# EAGLE design PM-BAT v1.0-35X22.86 (EAGLE 9.6.2)
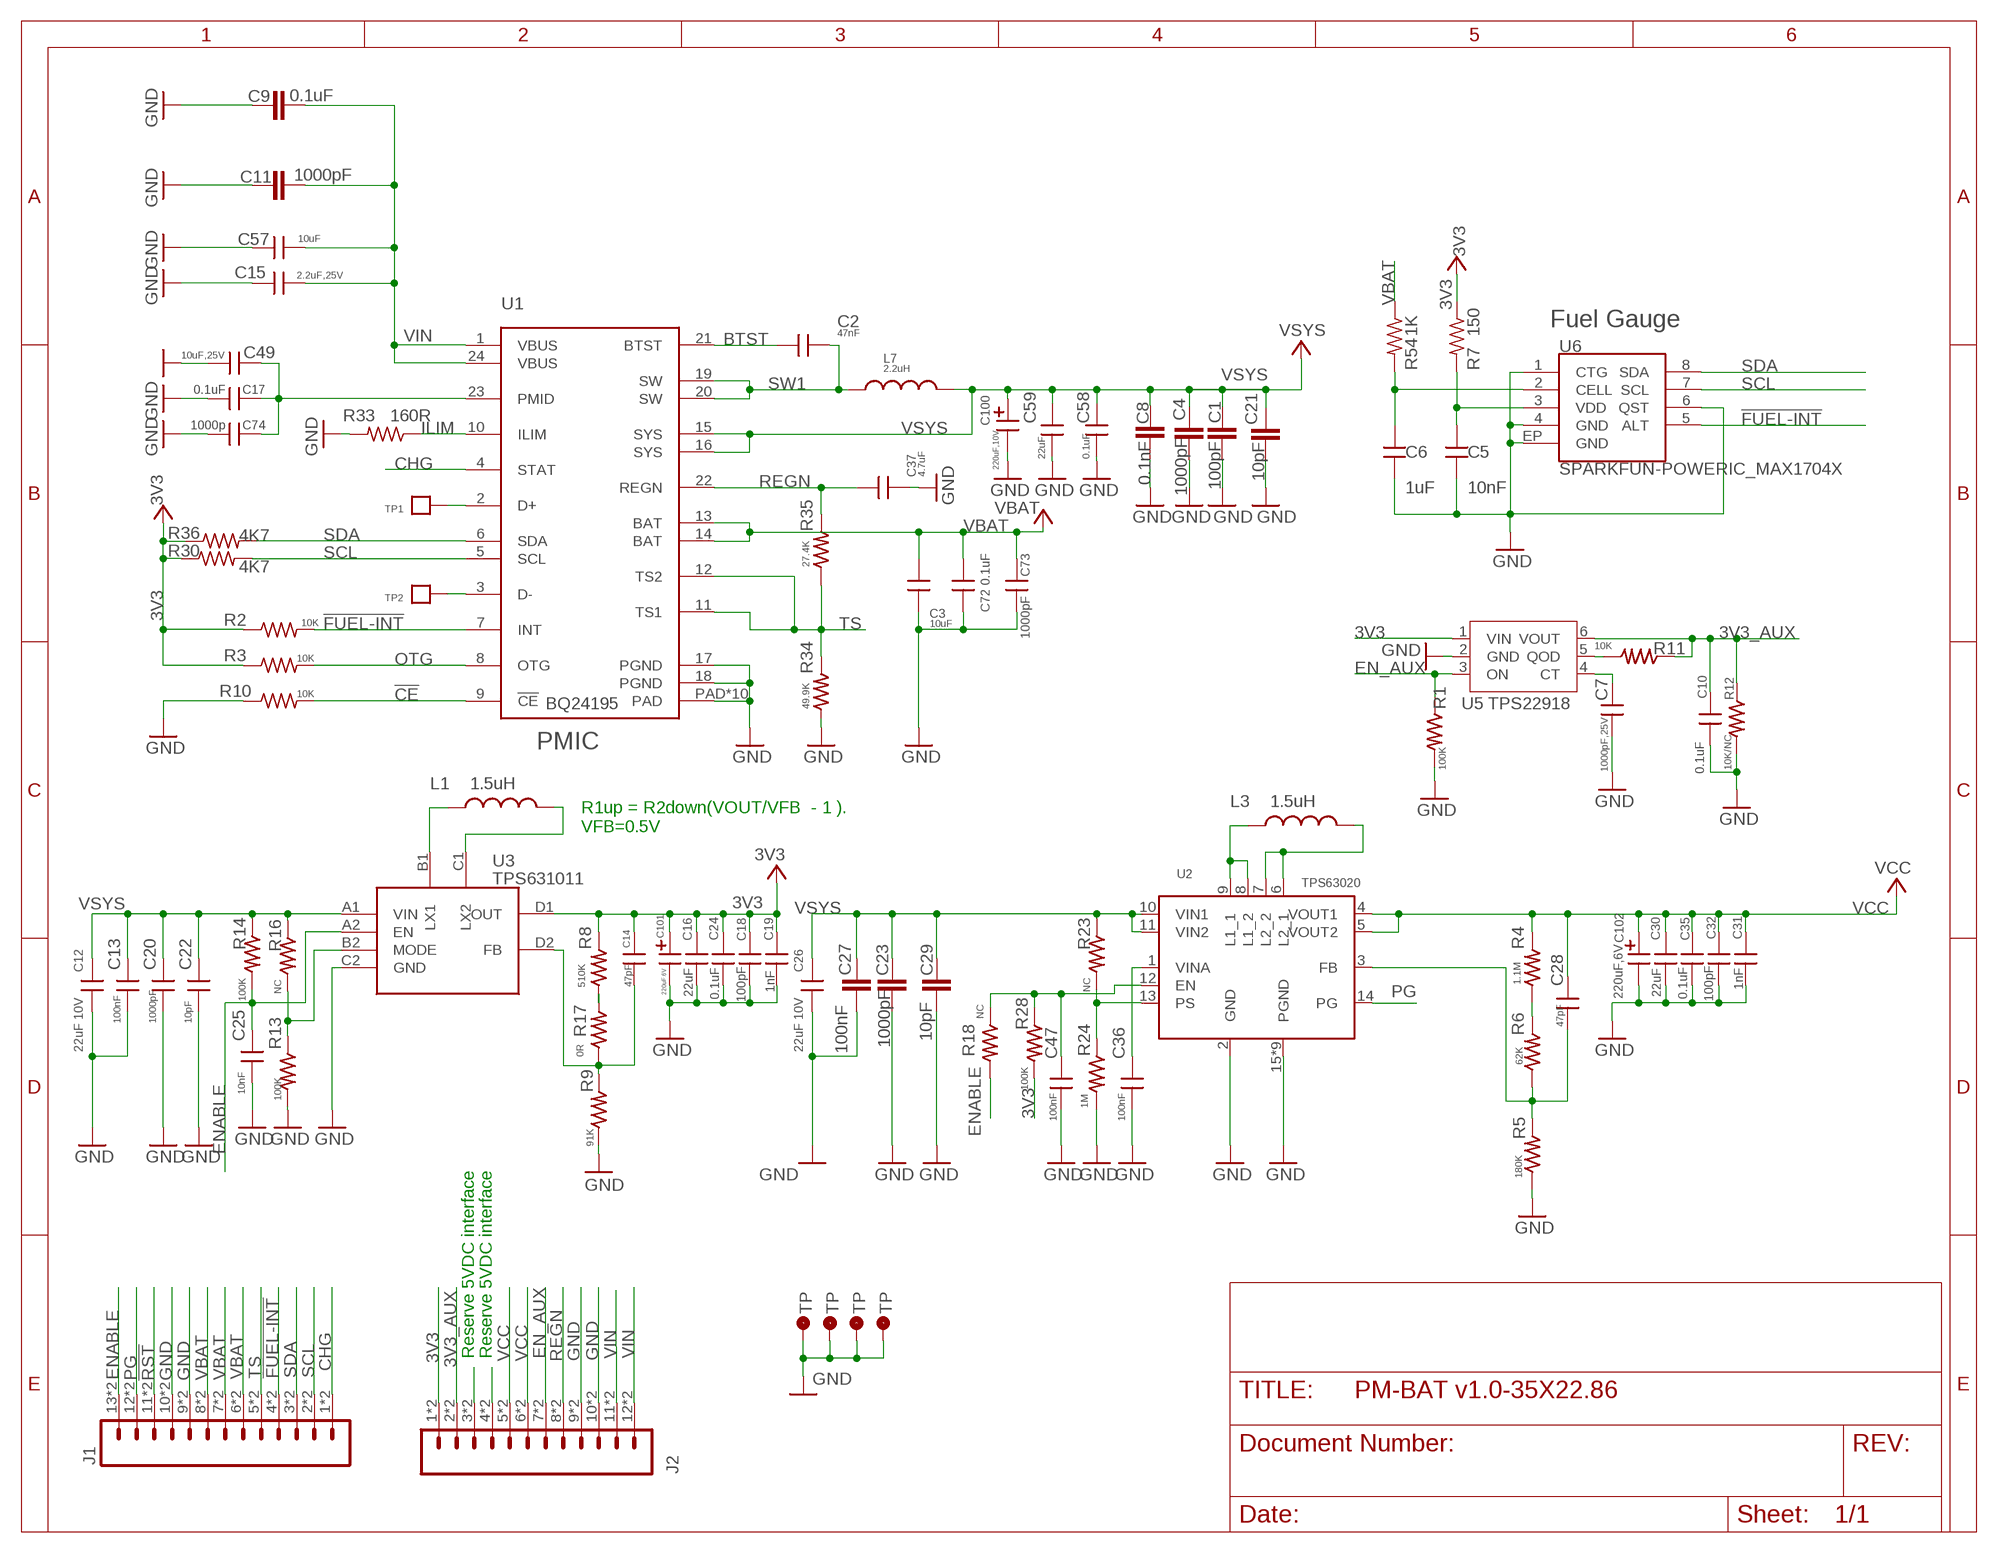
[diagram p0: schematic, sheet 1]

## Parts
C1  100pF  CAP_1  [C0402_B]
C2  47nF  CAP0402  [C-0402]
C3  10uF  CAPC0805  [C0805]
C4  1000pF  CAP_1  [C0402_B]
C5  10nF  CAP0402A  [C0402]
C6  1uF  CAP0402A  [C0402]
C7  1000pF,25V  CAP0402A  [C0402]
C8  0.1nF  CAP_1  [C0402_B]
C9  0.1uF  CAP_1  [C0402_B]
C10  0.1uF  CAPC0201-N  [C0201-N]
C11  1000pF  CAP_1  [C0402_B]
C12  22uF 10V  CAPC0603  [C0603]
C13  100nF  CAPC0201-N  [C0201-N]
C14  47pF  CAPC0201-N  [C0201-N]
C15  2.2uF,25V  CAP0603A  [C-0603A]
C16  22uF  CAP0603A  [C-0603A]
C17  0.1uF  CAP0402A  [C0402]
C18  100pF  CAP0402A  [C0402]
C19  1nF  CAP0402A  [C0402]
C20  1000pF  CAPC0201-N  [C0201-N]
C21  10pF  CAP_1  [C0402_B]
C22  10pF  CAPC0201-N  [C0201-N]
C23  1000pF  CAP_1  [C0402_B]
C24  0.1uF  CAP0402A  [C0402]
C25  10nF  CAPC0201-N  [C0201-N]
C26  22uF 10V  CAPC0603  [C0603]
C27  100nF  CAP_1  [C0402_B]
C28  47pF  CAPC0201-N  [C0201-N]
C29  10pF  CAP_1  [C0402_B]
C30  22uF  CAP0603A  [C-0603A]
C31  1nF  CAP0402A  [C0402]
C32  100pF  CAP0402A  [C0402]
C35  0.1uF  CAP0402A  [C0402]
C36  100nF  CAPC0201-N  [C0201-N]
C37  4.7uF  CAP0402A  [C0402]
C47  100nF  CAPC0201-N  [C0201-N]
C49  10uF,25V  CAP0603A  [C-0603A]
C57  10uF  CAP0603A  [C-0603A]
C58  0.1uF  CAP0402A  [C0402]
C59  22uF  CAPC0603  [C0603]
C72  0.1uF  CAP0402  [C-0402]
C73  1000pF  CAP0402  [C-0402]
C74  1000p  CAP0402  [C-0402]
C100  220uF,10V  CAP-ECASE_B  [CASE-B]
C101  220uF.6V  CAP-ECASE_B  [CASE-B]
C102  220uF,6V  CAP-ECASE_B  [CASE-B]
J1  M13PTH-CST-R  [1X13-CASTELLATED]
J2  M12PTH-CST-R  [1X12-CASTELLATED]
L1  1.5uH  INDUCTOR-SPARKFUNINDUCTOR-2520  [INDUCTOR-2520]
L3  1.5uH  INDUCTOR-SPARKFUNINDUCTOR-2520  [INDUCTOR-2520]
L7  2.2uH  INDUCTORI  [INDUCTOR-4040]
R1  100K  RESR0201-N  [R0201-N]
R2  10K  R-US_  [R0402_B]
R3  10K  R-US_  [R0402_B]
R4  1.1M  RESR0201-N  [R0201-N]
R5  180K  RESR0201-N  [R0201-N]
R6  62K  RESR0201-N  [R0201-N]
R7  150  R-US_  [R0402_B]
R8  510K  RESR0201-N  [R0201-N]
R9  91K  RESR0201-N  [R0201-N]
R10  10K  R-US_  [R0402_B]
R11  10K  RESR0201-N  [R0201-N]
R12  10K/NC  RESR0201-N  [R0201-N]
R13  100K  RESR0201-N  [R0201-N]
R14  100K  RESR0201-N  [R0201-N]
R16  NC  RESR0201-N  [R0201-N]
R17  0R  RESR0201-N  [R0201-N]
R18  NC  RESR0201-N  [R0201-N]
R23  NC  RESR0201-N  [R0201-N]
R24  1M  RESR0201-N  [R0201-N]
R28  100K  RESR0201-N  [R0201-N]
R30  4K7  R-US_  [R0402_B]
R33  160R  R-US_  [R0402_B]
R34  49.9K  RESR0201-N  [R0201-N]
R35  27.4K  RESR0201-N  [R0201-N]
R36  4K7  R-US_  [R0402_B]
R54  1K  R-US_  [R0402_B]
TP1  TP1311MM  [TP-1311MM]
TP2  TP1311MM  [TP-1311MM]
U1  BQ24195  ELECTRON_BQ24298RTWR  [ELECTRON_QFN24]
U2  TPS63020  [TPS63020]
U3  TPS631011  TPS631010  [DSBGA]
U5  TPS22918  [SOT-23-6]
U6  SPARKFUN-POWERIC_MAX1704X  [SPARKFUN-POWERIC_TDFN-8]
U$1  TP  [TP_2.33X1.37]
U$2  TP  [TP_2.33X1.37]
U$4  TP  [TP_2.33X1.37]
U$5  TP  [TP_2.33X1.37]

## Nets
3V3: C14.1 C16.1 C18.1 C19.1 C24.1 C101.P$1 J2.1 J2.@1 R2.1 R3.1 R7.1 R8.2 R28.2 R30.1 R36.1 U3.D1(OUT) U5.1(VIN)
3V3_AUX: C10.1 J2.2 J2.@2 R11.1 R12.1 U5.6(VOUT)
!CE: R10.2 U1.9(!CE)
!FUEL-INT: J1.4 J1.@4 R2.2 U1.7(INT) U6.5(ALT)
!RST: J1.11 J1.@11
BTST: C2.1 U1.21(BTST)
CHG: J1.1 J1.@1 U1.4(STAT)
EN_AUX: J2.7 J2.@7 R1.1 U5.3(ON)
ENABLE: C25.1 J1.13 J1.@13 R14.2 R18.2 U3.A2(EN)
GND: C1.1 C3.2 C4.1 C5.2 C6.2 C7.2 C8.1 C9.1 C10.2 C11.1 C12.2 C13.2 C15.2 C16.2 C17.1 C18.2 C19.2 C20.2 C21.1 C22.2 C23.1 C24.2 C25.2 C26.2 C27.1 C29.1 C30.2 C31.2 C32.2 C35.2 C36.2 C37.2 C47.2 C49.2 C57.2 C58.2 C59.2 C72.2 C73.2 C74.1 C100.P$2 C101.P$2 C102.P$2 J1.9 J1.10 J1.@9 J1.@10 J2.9 J2.10 J2.@9 J2.@10 R1.2 R5.1 R9.1 R10.1 R12.2 R13.2 R24.2 R33.2 R34.1 U1.17(PGND) U1.18(PGND) U1.PAD U1.PAD@1(PAD) U1.PAD@2(PAD) U1.PAD@3(PAD) U1.PAD@4(PAD) U1.PAD@5(PAD) U1.PAD@6(PAD) U1.PAD@7(PAD) U1.PAD@8(PAD) U1.PAD@9(PAD) U2.2(GND) U2.15(PGND) U2.16(PGND) U2.17(PGND) U2.18(PGND) U2.19(PGND) U2.20(PGND) U2.21(PGND) U2.22(PGND) U2.23(PGND) U3.C2(GND) U5.2(GND) U6.1(CTG) U6.4(GND) U6.6(QST) U6.EP(GND) U$1.1(TP) U$2.1(TP) U$4.1(TP) U$5.1(TP)
ILIM: R33.1 U1.10(ILIM)
N$1: J2.3 J2.@3
N$2: C17.2 C49.1 C74.2 U1.23(PMID)
N$4: TP2.P$1 U1.3(D-)
N$5: C14.2 R9.2 R17.1 U3.D2(FB)
N$6: C28.2 R5.2 R6.1 U2.3(FB)
N$7: TP1.P$1 U1.2(D+)
N$8: R8.1 R17.2
N$9: R4.1 R6.2
N$10: J2.4 J2.@4
N$11: L3.1 U2.8(L1_2) U2.9(L1_1)
N$12: L1.1 U3.B1(LX1)
N$15: R13.1 R16.2 U3.B2(MODE)
N$16: L3.2 U2.6(L2_1) U2.7(L2_2)
N$17: L1.2 U3.C1(LX2)
N$18: C7.1 U5.4(CT)
N$19: C36.1 U2.1(VINA)
N$20: R11.2 U5.5(QOD)
N$21: C47.1 R18.1 R28.1 U2.12(EN)
N$22: R23.2 R24.1 U2.13(PS)
N$48: C5.1 R7.2 U6.3(VDD)
N$49: C6.1 R54.2 U6.2(CELL)
OTG: R3.2 U1.8(OTG)
PG: J1.12 J1.@12 U2.14(PG)
REGN: C37.1 J2.8 J2.@8 R35.2 U1.22(REGN)
SCL: J1.2 J1.@2 R30.2 U1.5(SCL) U6.7(SCL)
SDA: J1.3 J1.@3 R36.2 U1.6(SDA) U6.8(SDA)
SW1: C2.2 L7.P$1 U1.19(SW) U1.20(SW)
TS: J1.5 J1.@5 R34.2 R35.1 U1.11(TS1) U1.12(TS2)
VBAT: C3.1 C72.1 C73.1 J1.6 J1.7 J1.8 J1.@6 J1.@7 J1.@8 R54.1 U1.13(BAT) U1.14(BAT)
VCC: C28.1 C30.1 C31.1 C32.1 C35.1 C102.P$1 J2.5 J2.6 J2.@5 J2.@6 R4.2 U2.4(VOUT1) U2.5(VOUT2)
VIN: C9.2 C11.2 C15.1 C57.1 J2.11 J2.12 J2.@11 J2.@12 U1.1(VBUS) U1.24(VBUS)
VSYS: C1.2 C4.2 C8.2 C12.1 C13.1 C20.1 C21.2 C22.1 C23.2 C26.1 C27.2 C29.2 C58.1 C59.1 C100.P$1 L7.P$2 R14.1 R16.1 R23.1 U1.15(SYS) U1.16(SYS) U2.10(VIN1) U2.11(VIN2) U3.A1(VIN)

## Notes on the sheet
- Fuel Gauge
- PMIC
- R1up = R2down(VOUT/VFB  - 1 ).
  VFB=0.5V
- Reserve 5VDC interface | Reserve 5VDC interface

## Library data of the parts
C1 = Particle:CAP_1; ITEM_NAME: CAP CER 100pF 50V X7R 0402 10%; ITEM_NUMBER: PT-200138
C2 = particle SZ:CAP: CAP; ITEM_NAME: CAP CER 0.1uF 16V X7R 0402 10%; ITEM_NUMBER: PT-200005
C3 C13 C14 C20 C22 C25 C28 C36 C37 C47 C58 C59 = particle SZ:CAP: CAP; ITEM_NAME: CAP CER 10uF 6.3V X5R 0603 10% Low ESR<70mohms; ITEM_NUMBER: PT-200209
C4 C23 = Particle:CAP_1; ITEM_NAME: CAP CER 1000PF 50V X7R 0402 10%
C5 = particle SZ:CAP: CAP; ITEM_NAME: CAP CER 10nF 16V X5R 0402 10%; ITEM_NUMBER: PT-200136
C6 = particle SZ:CAP: CAP; ITEM_NAME: CAP CER X5R 1uF 0402 10V ±10% ROHS; ITEM_NUMBER: PT-200695
C7 C15 C49 C57 = particle SZ:CAP: CAP; ITEM_NAME: CAP CER 100PF 50V C0G/NP0 0603 5%; ITEM_NUMBER: PT-200458
C8 C27 = Particle:CAP_1; ITEM_NAME: CAP CER 0.1UF 16V X7R 0402 10%; ITEM_NUMBER: PT-200649
C9 = Particle:CAP_1; ITEM_NAME: CAP CER 0.1UF 25V X7R 0402 20%; ITEM_NUMBER: PT-200690
C10 C24 C35 = particle SZ:CAP: CAP; ITEM_NAME: 0.1UF 16V X7R 0402 10%; ITEM_NUMBER: PT-200649
C11 = Particle:CAP_1; ITEM_NAME: CAP CER 1000PF 50V X7R 0402 10%; ITEM_NUMBER: PT-200631
C12 C26 = particle SZ:CAP: CAP; ITEM_NAME: CAP CER 0.1UF 16V X7R 0402 10%; ITEM_NUMBER: 120-00060
C16 C30 = particle SZ:CAP: CAP; ITEM_NAME: CAP CER 22UF 10V X5R 0603 20%; ITEM_NUMBER: 120-00061
C17 = RedBear:CAP: CAP; ITEM_NAME: CAP CER 0.1UF 25V X7R 0402 20%; ITEM_NUMBER: PT-200690
C18 C32 = particle SZ:CAP: CAP; ITEM_NAME: 100pF 50V X7R 0402 10%; ITEM_NUMBER: PT-200138
C19 C31 C73 = particle SZ:CAP: CAP; ITEM_NAME: 1000PF 50V X7R 0402 10%; ITEM_NUMBER: PT-200631
C21 C29 = Particle:CAP_1; ITEM_NAME: CAP CER 10PF 5% 50V C0G/NP0 0402; ITEM_NUMBER: 120-00038
C72 = particle SZ:CAP: CAP; ITEM_NAME: CAP CER 0.1UF 16V X7R 0402 10%; ITEM_NUMBER: PT-200649
C74 = particle SZ:CAP: CAP; ITEM_NAME: CAP CER 1000PF 50V X7R 0402 10%; ITEM_NUMBER: PT-200631
C100-C102 = particle SZ:CAP-E
J1 = Particle:M13PTH-CST-R
J2 = Particle:M12: Header 12 Standard 12-pin 0.1" header. Use with straight break away headers (SKU : PRT-00116), right angle break away headers (PRT-00553), swiss pins (PRT-00743), machine pins (PRT-00117), and female headers (PRT-00115).
L1 L3 = PM-BAT v0.5-35X22.86:INDUCTOR-SPARKFUN: Inductors Basic Inductor/Choke - 0603 and 1206. Footprints are not proven and vary greatly between part numbers. SRN6045- 33uH, 20% 1.4A
L7 = Particle:INDUCTOR; ITEM_NAME: FIXED IND 1UH 5.8A 26 MOHM SMD 4020; ITEM_NUMBER: 155-00005
R1 R8 R13 R14 R16 R23 = particle SZ:RES: RES; ITEM_NAME: RES SMD 1M OHM 1% 1/16W 0402; ITEM_NUMBER: PT-201084
R2 R3 R10 = Spark:R-US_: 0402 Resistor; ITEM_NAME: 10K OHM 5% 1/16W 0402; ITEM_NUMBER: PT-200004
R4-R6 R9 R18 R24 R28 R34 R35 = particle SZ:RES: RES
R7 R33 = Particle:R-US_: 0402 Resistor
R11 R12 = particle SZ:RES: RES; ITEM_NAME: 10K OHM 5% 1/16W 0402; ITEM_NUMBER: PT-200004
R17 = particle SZ:RES: RES; ITEM_NAME: RES SMD 24K OHM 1% 1/16W 0402; ITEM_NUMBER: PT-201025
R30 R36 = Particle:R-US_: 0402 Resistor; ITEM_NAME: RES SMD 4K7 OHM 5% 1/16W 0402; ITEM_NUMBER: PT-200230
R54 = Particle:R-US_: 0402 Resistor; ITEM_NAME: RES SMD 1K OHM 5% 1/16W 0402; ITEM_NUMBER: PT-200002
TP1 TP2 = particle SZ:TP
U1 = ELEKTRA-PMIC v0.3-35X22.86-0.8-0402:ELECTRON_BQ24298RTWR: Bq24298 I2C Controlled 3A Single Cell USB Charger with Narrow VDC Power Path Management and Adjustable Voltage USB OTG
U2 = particle SZ:TPS63020
U3 = particle SZ:TPS631010
U5 = particle SZ:TPS22918
U6 = ELEKTRA-PMIC v0.3-35X22.86-0.8-0402:SPARKFUN-POWERIC_MAX1704X: MAX17043/MAX17044: Battery Fuel Guage (43 is 1cell, 44 is 2cell)
U$1 U$2 U$4 U$5 = Particle:TP: Test Points of all sizes and shapes

## Net classes
0 default: width 0.152 mm, drill 0.203 mm, clearance 0.152 mm
1 power: width 0.305 mm, drill 0.203 mm, clearance 0.203 mm
3 BAT: drill 0.203 mm, clearance 0.203 mm
4 3V3: width 0.305 mm, drill 0.203 mm, clearance 0.508 mm
6 +3V3: width 0.203 mm, drill 0.203 mm, clearance 0.152 mm

## Board
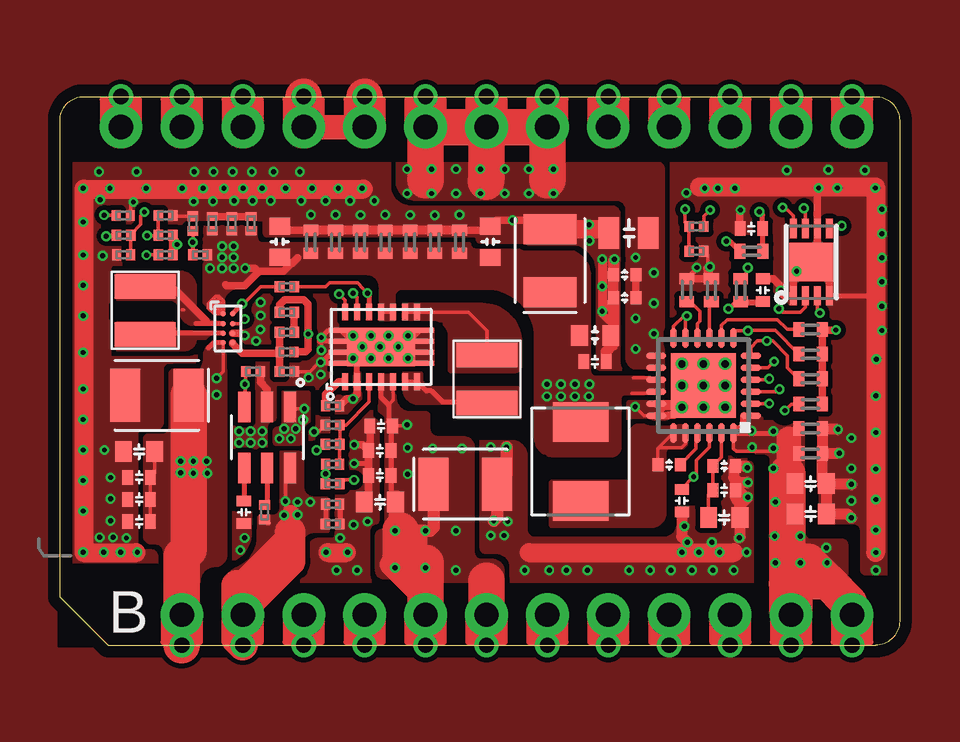
[diagram p1: board, top side]
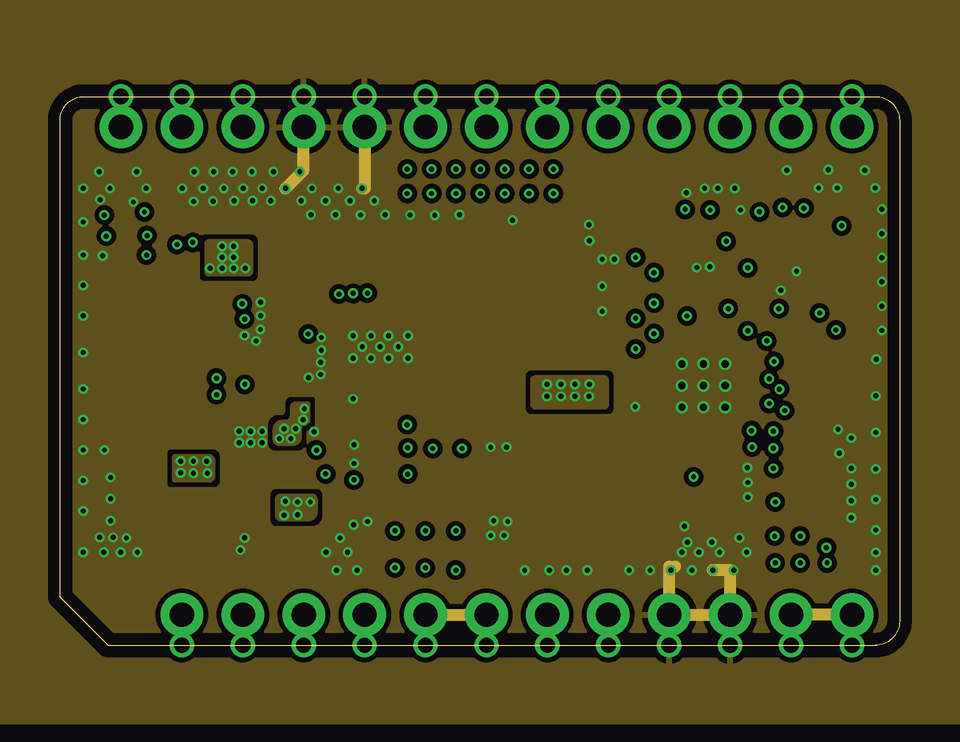
[diagram p2: board, inner layer Route2]
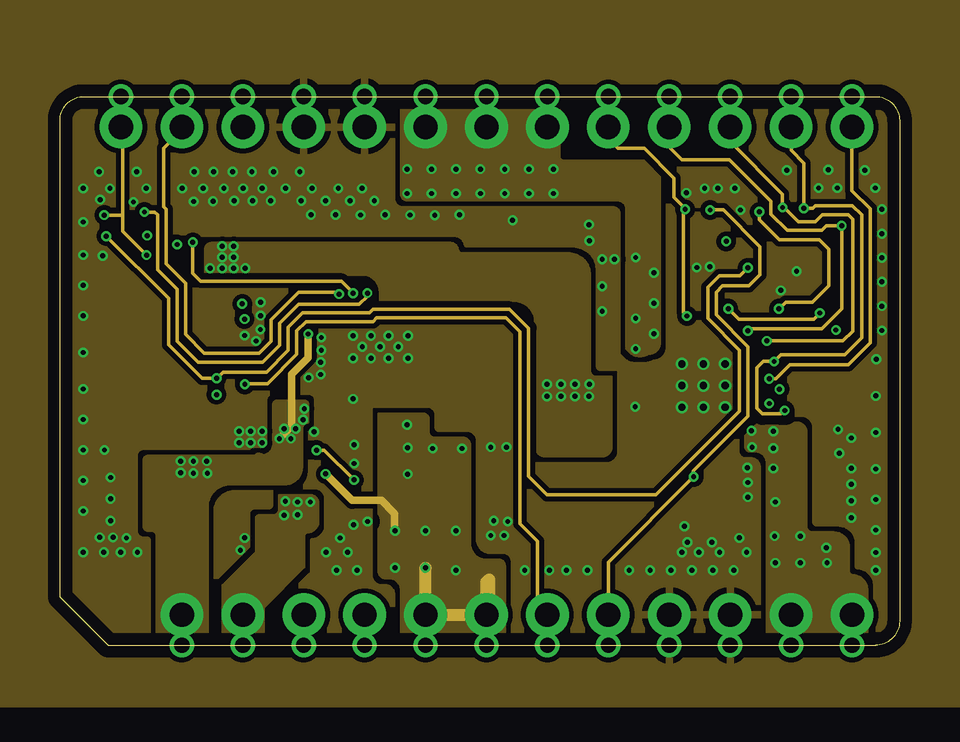
[diagram p3: board, inner layer Route15]
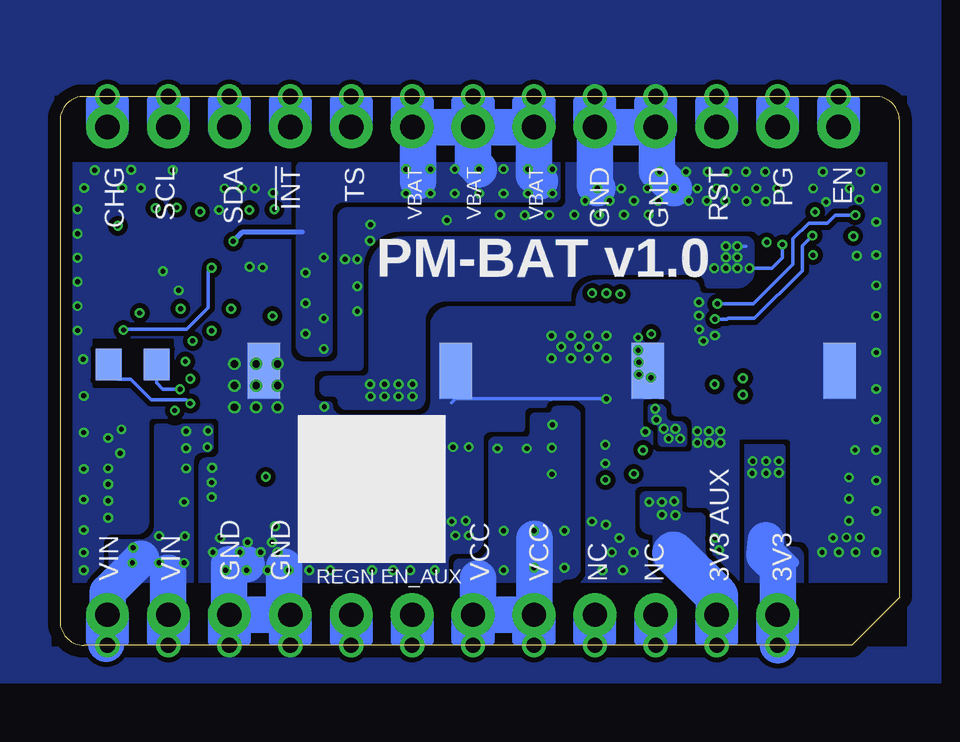
[diagram p4: board, bottom side, seen from below]

Size 35 x 22.86 mm. Coordinates in mm from the lower left corner, seen from the top.
Outline: 2,0 34,0 arc90 35,1 35,21.86 arc90 34,22.86 1,22.86 arc90 0,21.86 0,2 2,0
Copper layers (1+2*15+16): Top 0.035mm / dielectric 1.5mm / Route2 0.035mm / dielectric 0.15mm / Route15 0.035mm / dielectric 0.2mm / Bottom 0.035mm
Design rules "default *": minimum track width 4mil, minimum drill 8mil, track to track 8mil, track to pad 6mil, pad to pad 6mil, via to via 6mil, smd to smd 6mil, copper to edge 20mil, drill to drill 6mil, minimum pad ring 4mil, minimum via ring 4mil, stop-mask expansion 0.01mm, vias tented up to drill 16mil, thermal gap 10mil
tRestrict: 1 lines

### Footprints (pad centres in the part's own frame; a part is rotated, then mirrored left to right if it is on the bottom)
C0402_B = smd 0.457 x 0.61: 1 -0.483,0; 2 0.483,0
C-0402 = smd 0.45 x 0.55: 1 -0.47,0; 2 0.47,0
C0805 = smd 0.85 x 1.3: 1 -0.8,0; 2 0.85,0
C0402 = smd 0.45 x 0.6: 1 -0.47,0; 2 0.47,0
C0201-N = smd 0.37 x 0.45: 1 -0.295,0; 2 0.295,0
C0603 = smd 0.7 x 0.85: 1 -0.65,0; 2 0.65,0
C-0603A = smd 0.7 x 0.85: 1 -0.65,0; 2 0.65,0
CASE-B = smd 2.2 x 1.25: P$1 0,-1.32; P$2 0,1.32
1X13-CASTELLATED = drill 1.016 pad 1.778: 1 0,-15.24; 2 0,-12.7; 3 0,-10.16; 4 0,-7.62; 5 0,-5.08; 6 0,-2.54; 7 0,0; 8 0,2.54; 9 0,5.08; 10 0,7.62; 11 0,10.16; 12 0,12.7; 13 0,15.24 | drill 0.635 pad 1.016: @1 1.27,-15.24; @2 1.27,-12.7; @3 1.27,-10.16; @4 1.27,-7.62; @5 1.27,-5.08; @6 1.27,-2.54; @7 1.27,0; @8 1.27,2.54; @9 1.27,5.08; @10 1.27,7.62; @11 1.27,10.16; @12 1.27,12.7; @13 1.27,15.24
1X12-CASTELLATED = drill 1.016 pad 1.778: 1 0,-13.97; 2 0,-11.43; 3 0,-8.89; 4 0,-6.35; 5 0,-3.81; 6 0,-1.27; 7 0,1.27; 8 0,3.81; 9 0,6.35; 10 0,8.89; 11 0,11.43; 12 0,13.97 | drill 0.635 pad 1.016: @1 1.27,-13.97; @2 1.27,-11.43; @3 1.27,-8.89; @4 1.27,-6.35; @5 1.27,-3.81; @6 1.27,-1.27; @7 1.27,1.27; @8 1.27,3.81; @9 1.27,6.35; @10 1.27,8.89; @11 1.27,11.43; @12 1.27,13.97
INDUCTOR-2520 = smd 1.02 x 2.54: 1 -1,0; 2 1,0
INDUCTOR-4040 = smd 1.65 x 2.3: P$1 -1.65,0; P$2 1.65,0
R0201-N = smd 0.4 x 0.45: 1 -0.305,0; 2 0.305,0
R0402_B = smd 0.457 x 0.61: 1 -0.483,0; 2 0.483,0
TP-1311MM = smd 1.1 x 1.3: P$1 0,0
ELECTRON_QFN24 = smd 0.85 x 0.28: 1 -1.975,1.25; 2 -1.975,0.75; 3 -1.975,0.25; 4 -1.975,-0.25; 5 -1.975,-0.75; 6 -1.975,-1.25; 13 1.975,-1.25; 14 1.975,-0.75; 15 1.975,-0.25; 16 1.975,0.25; 17 1.975,0.75; 18 1.975,1.25 | smd 0.28 x 0.85: 7 -1.25,-1.975; 8 -0.75,-1.975; 9 -0.25,-1.975; 10 0.25,-1.975; 11 0.75,-1.975; 12 1.25,-1.975; 19 1.25,1.975; 20 0.75,1.975; 21 0.25,1.975; 22 -0.25,1.975; 23 -0.75,1.975; 24 -1.25,1.975 | smd 2.7 x 2.7: PAD 0,0 | drill 0.3 pad 0.406: PAD@1 -0.9,0.9; PAD@2 0,0.9; PAD@3 0.9,0.9; PAD@4 -0.9,0; PAD@5 0,0; PAD@6 0.9,0; PAD@7 -0.9,-0.9; PAD@8 0,-0.9; PAD@9 0.9,-0.9
TPS63020 = smd 0.25 x 0.7: 1 -1.5,-1.45; 2 -1,-1.45; 3 -0.5,-1.45; 4 0,-1.45; 5 0.5,-1.45; 6 1,-1.45; 7 1.5,-1.45; 8 1.5,1.45; 9 1,1.45; 10 0.5,1.45; 11 0,1.45; 12 -0.5,1.45; 13 -1,1.45; 14 -1.5,1.45 | smd 1.1 x 0.2: 15 -1.65,0.69; 16 -1.65,0.23; 17 -1.65,-0.23; 18 -1.65,-0.69; 19 1.65,-0.69; 20 1.65,-0.23; 21 1.65,0.23; 22 1.65,0.69 | smd 2.85 x 1.58: 23 0,0
DSBGA = smd 0.23 x 0.23: A1 -0.2,0.6; A2 0.2,0.6; B1 -0.2,0.2; B2 0.2,0.2; C1 -0.2,-0.2; C2 0.2,-0.2; D1 -0.2,-0.6; D2 0.2,-0.6
SOT-23-6 = smd 1.27 x 0.508: 1 -1.27,0.953; 2 -1.27,0; 3 -1.27,-0.953; 4 1.27,-0.953; 5 1.27,0; 6 1.27,0.953
SPARKFUN-POWERIC_TDFN-8 = smd 0.8 x 0.3: 1 -1.4,0.75; 2 -1.4,0.25; 3 -1.4,-0.25; 4 -1.4,-0.75; 5 1.4,-0.75; 6 1.4,-0.25; 7 1.4,0.25; 8 1.4,0.75 | smd 1.6 x 1.88: EP 0,0
TP_2.33X1.37 = smd 1.37 x 2.33: 1 0,0

### Placement (x,y rotation side)
C1  14.6,16.81 270 top
C2  25.4,7.52 180 top
C3  23.72,17.17 180 top
C4  15.63,16.81 270 top
C5  29.3,14.79 90 top
C6  28.82,17.36 180 top
C7  7.67,5.54 270 top
C8  16.66,16.81 270 top
C9  31.29,7.99 180 top
C10  11.37,5.87 0 top
C11  31.29,9.03 180 top
C12  9.16,16.81 90 top
C13  7.97,17.57 90 top
C14  9.46,12.22 180 top
C15  31.29,6.73 0 top
C16  3.3,8.07 180 top
C17  27.69,6.46 180 top
C18  3.3,6.07 180 top
C19  3.3,7 180 top
C20  7.16,17.57 90 top
C21  13.56,16.81 270 top
C22  6.35,17.57 90 top
C23  11.49,16.81 270 top
C24  3.3,5.15 180 top
C25  2.64,17.91 0 top
C26  17.94,16.81 90 top
C27  12.53,16.81 270 top
C28  11.37,7.54 0 top
C29  10.46,16.81 270 top
C30  13.34,5.96 180 top
C31  13.39,9.14 180 top
C32  13.34,8.11 180 top
C35  13.34,7.07 180 top
C36  11.37,9.98 0 top
C37  25.93,6.02 270 top
C47  2.66,16.27 180 top
C49  27.69,5.32 0 top
C57  31.29,5.47 0 top
C58  22.3,11.81 0 top
C59  22.3,12.91 0 top
C72  23.54,14.48 180 top
C73  23.54,15.44 180 top
C74  27.69,7.47 180 top
C100  20.43,16.02 0 top
C101  4.04,10.41 90 top
C102  16.89,6.71 270 top
J1  17.78,21.59 90 top
J2  19.05,1.27 270 top
L1  3.56,13.95 270 top
L3  17.8,11.09 270 top
L7  21.7,7.65 90 top
R1  8.05,11.4 0 top
R2  31.29,12.13 180 top
R3  31.29,13.16 180 top
R4  11.37,6.72 180 top
R5  11.37,9.18 0 top
R6  11.37,8.37 180 top
R7  28.37,14.79 270 top
R8  9.46,13.87 180 top
R9  9.46,11.4 180 top
R10  27.15,14.79 270 top
R11  8.53,5.54 90 top
R12  11.37,5.05 0 top
R13  4.4,17.91 0 top
R14  4.4,16.27 180 top
R16  4.4,17.08 180 top
R17  9.46,13.04 0 top
R18  9.46,14.94 180 top
R23  5.85,16.27 180 top
R24  5.55,17.57 90 top
R28  2.66,17.08 180 top
R30  31.29,10.05 180 top
R33  26.13,14.79 90 top
R34  26.53,16.42 180 top
R35  26.53,17.45 0 top
R36  31.29,11.1 180 top
R54  28.82,16.42 0 top
TP1  32.97,11.7 180 bottom
TP2  30.97,11.7 180 bottom
U1  26.83,10.82 180 top
U2  13.39,12.43 0 top
U3  7.01,13.2 0 top
U5  8.64,8.66 270 top
U6  31.32,15.96 90 top
U$1  2.5,11.43 0 bottom
U$2  10.5,11.43 0 bottom
U$4  18.5,11.43 0 bottom
U$5  26.5,11.43 0 bottom

### Tracks (layer width: path | path; a pad name or v marks a point on that pad's centre or on a via)
3V3  (via drill 0.2 pad 0.41)
  Top 0.152: 5,3.58 5.13,3.71 5.13,3.76 4.93,3.96 | R7.1 28.68,15.58 v28.68,15.72 | U3.D1 6.8,11.4 v6.53,11.12 | R30.1 | v10.19,9.86 9.66,9.86 U5.1 | C16.1 3.95,7.18 C19.1 C18.1 C24.1 | R28.2 1.97,17.08 v1.93,17.04
  Top 0.203: U3.D1 6.41,12.6 6.19,12.38 | R2.1 R3.1 32.33,13.16 v32.35,13.13
  Top 0.305: v32.35,13.13 31.82,13.13 31.77,13.09 R36.1 R30.1 | 5.92,10.03 5.74,10.03 C101.P$1 | R8.2 9.16,14.19 9.37,14.4 10.16,14.4 10.35,14.22 v10.35,12.97 10.35,12.33 10.24,12.22 C14.1
  Top 1.524: 5.08,3.71 5.36,3.99 C101.P$1 | J2.1 J2.@1 5.08,3.66 5.13,3.71
  Route2 0.508: J2.@1 J2.1
  Route15 0.152: v1.93,17.04 4.52,14.45 4.52,12.53 5.92,11.12 v6.53,11.12 6.55,11.12 6.81,11.38 8.61,11.38 9.51,12.28 9.51,13.25 10.11,13.84 12.9,13.84 13.06,13.99 18.75,13.99 19.53,13.21 19.53,7.04 20.3,6.27 24.84,6.27 28.32,9.76 28.32,12.3 27,13.62 27,14.91 27.48,15.39 28.35,15.39 v28.68,15.72
  Route15 0.305: v9.14,8.61 9.65,9.12 9.65,11.29 10.35,11.98 v10.35,12.97
  Route15 0.508: J2.@1 J2.1
  Bottom 0.152: v28.68,15.72 28.82,15.58 28.82,14.06 29.72,13.16 32.33,13.16 v32.35,13.13
  Bottom 0.203: J2.1 4.88,1.03 5.29,0.61 5.29,0.86
  Bottom 0.457: 4.42,3.45 4.93,3.96
  Bottom 1.524: 5.56,4.37 5.63,3.75 5.08,3.2 J2.1 J2.@1
  other vias: 6.53,10.44 5.56,7.16 5.03,7.67 5.56,7.67 5.03,7.19 9.63,8.61 9.35,9.02 10.13,9.4 9.83,9.02 6.12,7.67 6.15,7.16
  pour Top (isolate 0.305, no thermals): 6.9,12.63 6.57,12.63 arc90 6.01,12.07 6.01,12 arc-90 4.93,10.92 arc90 4.78,10.77 4.78,3.3 6.22,3.3 arc90 6.9,3.98
  pour Bottom (no thermals): 4.9,8.33 6.43,8.33 6.43,2.49 4.11,2.49 arc-90 4.04,2.57 4.04,3.71 arc-90 4.39,4.06 4.5,4.06 arc90 4.8,4.37 4.8,8.23 arc-90
  pour Top (no thermals): 9.27,10.57 10.31,10.57 arc-90 10.41,10.46 10.41,9.42 arc-90 10.16,9.17 arc90 10.11,9.12 10.11,8.53 arc-90 9.93,8.36 9.02,8.36 arc-90 8.92,8.46 8.92,8.89 arc-90 9.09,9.07 arc90 9.27,9.25
  pour Top (no thermals): 5.99,11.48 4.75,11.48 arc90 4.57,11.3 4.57,9.07 arc-90 4.27,8.76 4.04,8.76 3.68,8.76 arc90 3.51,8.59 3.51,4.57 arc90 3.84,4.24 3.99,4.24 arc-90 4.34,3.89 4.34,2.64 arc90 4.45,2.54 5.82,2.54 5.82,2.67 arc-90 6.45,3.3 arc90 6.93,3.78 6.93,4.32 6.93,11.46 arc90 6.91,11.48
  pour Route15 (no thermals): 8.17,7.92 8.43,7.92 arc90
  pour Bottom: 10.3,10.04 arc-90 10.44,9.91 10.44,9.42 arc-90 10.24,9.22 10.19,9.22 arc90 10.03,9.07 10.03,8.51 arc-90 9.83,8.31 9.02,8.31 arc-90 8.92,8.41 8.92,9.02 arc-90 9.19,9.3 9.5,9.3 arc90 9.75,9.55 9.75,9.8 arc-90
  pour Route2: 9.86,10.11 10.31,10.11 arc-90 10.39,10.03 10.39,9.35 arc-90 10.24,9.19 10.16,9.19 arc90 10.03,9.07 10.03,8.66 arc-90 9.73,8.36 9.14,8.36 arc-90 8.92,8.59 8.92,8.99 arc-90 9.27,9.35 9.45,9.35 arc90 9.63,9.53 9.63,9.88 arc-90
  pour Route2: 4.83,7.92 6.17,7.92 arc-90 6.43,7.67 6.43,7.04 arc-90 6.22,6.83 4.8,6.83 arc-90 4.72,6.91 4.72,7.82 arc-90
  pour Route15 (no thermals): 9.07,10.19 10.19,10.19 arc-90 10.34,10.03 10.34,9.27 arc90 10.08,9.02 10.08,7.42 arc-90 9.37,6.71 7.11,6.71 arc90 6.15,5.74 6.15,0.48 arc-90 6.07,0.41 4.04,0.41 4.04,4.55 arc90 3.81,4.78 3.68,4.78 arc-90 3.48,4.98 3.48,7.67 arc-90 3.71,7.9 8.41,7.9 arc90 8.89,8.38 8.89,10.01 arc-90
3V3_AUX  (via drill 0.2 pad 0.41)
  Top 0.152: 9.63,5.46 9.4,5.69 v9.4,5.99 9.4,7.2 U5.6
  Top 0.203: R11.1 8.68,5.09 | R12.1 11.07,5.07 C10.1
  Top 0.762: J2.2 7.62,2.74 | 7.37,2.49 7.62,2.74 | 7.62,2.74 9.6,4.72 9.63,4.75 9.63,5.46
  Top 1.27: 7.37,1.37 7.37,0.25 J2.@2 | 7.37,1.37 8.99,3 | 7.37,2.49 7.37,1.37 | J2.2 7.62,1.52 9.6,3.5 9.6,4.72
  Bottom 1.27: J2.2 7.62,2.36 8.59,3.33
  Bottom 1.778: J2.2 7.62,2.06 9.42,3.86
  other vias: 9.91,5.97 10.44,5.97 9.35,5.41 9.91,5.44
  pour Top (no thermals): 9.19,8.05 9.93,8.05 arc-90 10.13,7.85 10.13,6.6 arc90 10.59,6.15 11.07,6.15 arc-90 11.2,6.02 11.2,4.78 arc-90 11.15,4.72 10.59,4.72 arc90 10.08,4.22 10.08,3.3 arc-90 9.83,3.05 arc90 8.64,1.85 8.64,0.97 arc-90 8.38,0.71 6.71,0.71 arc-90 6.68,0.74 6.68,2.08 arc-66 7.44,3.25 arc62 8.23,4.37 arc5 8.26,5.28 arc-90 8.36,5.38 8.86,5.38 arc90 9.19,5.71
  pour Route15 (no thermals): 9.14,6.25 10.44,6.25 arc-90 10.77,5.92 10.77,5.18 arc-90 10.29,4.7 arc90 10.19,4.6 10.19,3.25 8.48,1.55 8.48,0.51 8.46,0.48 6.83,0.48 6.78,0.53 6.78,2.49 8.18,3.89 8.18,5.28 arc-90 8.31,5.41 8.89,5.41 arc90 9.14,5.66
  pour Bottom: 9.17,6.32 arc-90 9.19,6.35 10.57,6.35 arc-90 10.77,6.15 10.77,5.08 arc-90 10.36,4.67 arc90 10.21,4.52 10.21,3.43 8.59,1.8 8.59,0.53 7.01,0.53 8.15,3.89 8.15,5.26 arc-90 8.36,5.46 8.92,5.46 arc90 9.14,5.69 9.14,6.32 arc-90 9.17,6.35
  pour Route2: 9.25,6.27 10.49,6.27 arc-90 10.69,6.07 10.69,5.56 arc-90 10.34,5.21 9.22,5.21 arc-90 9.02,5.41 9.02,6.07 arc-90 9.22,6.27
!CE
  Top 0.152: R10.2 27.18,14.29 27.08,14.19 U1.9
!FUEL-INT  (via drill 0.2 pad 0.41)
  Top 0.152: v32.59,17.48 32.19,17.48 U6.5 | U1.7 28.08,13.1 v28.68,13.1 28.7,13.12 29.82,13.12 R2.2
  Top 0.508: J1.@4 J1.4
  Route2 0.508: J1.@4 J1.4
  Route15 0.152: J1.4 25.4,20.75 25.93,20.22 27.91,20.22 29.64,18.49 29.64,17.96 30.32,17.28 31.76,17.28 31.95,17.48 v32.59,17.48 v32.59,17.47 32.59,14.02 31.75,13.18 28.77,13.18 v28.68,13.1
  Route15 0.508: J1.@4 J1.4
!RST
  Top 0.508: J1.@11 J1.11
  Route2 0.508: J1.@11 J1.11
  Route15 0.152: 7.62,21.61 J1.11
  Route15 0.508: J1.@11 7.62,21.61
  Bottom 0.152: 7.37,22.27 J1.11
BTST
  Top 0.152: U1.21 26.52,8.78 26.52,8.19 26.18,7.86 26.18,7.83 C2.1
CHG  (via drill 0.2 pad 0.41)
  Top 0.152: v29.57,11.1 29.54,11.07 U1.4
  Top 0.508: J1.@1 J1.1
  Route2 0.508: J1.@1 J1.1
  Route15 0.152: v29.57,11.1 29.84,11.1 30.43,11.68 32.88,11.68 33.78,12.59 33.78,18.18 33.02,18.94 J1.1
  Route15 0.508: J1.@1 J1.1
  Bottom 0.152: J1.@1 32.77,22.25
  Bottom 0.203: 32.77,22.25 32.77,22
EN_AUX  (via drill 0.2 pad 0.41)
  Top 0.152: U5.3 7.71,9.96 v7.71,10.87 7.75,10.91 R1.1 | J2.@7 J2.7
  Route15 0.152: v7.71,10.87 7.73,10.9 8.65,10.9 9.87,12.12 9.87,13.1 10.26,13.49 13.05,13.49 13.2,13.64 18.6,13.64 19.18,13.06 19.18,5.05 19.91,4.32 19.91,1.68 J2.7
ENABLE  (via drill 0.2 pad 0.41)
  Top 0.152: C25.1 2.33,17.92 v1.85,17.92 | R14.2 3.62,16.27 v3.61,16.26 | v7.59,14.22 7.66,14.22 8.37,14.94 R18.2
  Top 0.203: v7.59,14.22 7.59,14.19 U3.A2
  Top 0.508: J1.@13 J1.13
  Route2 0.508: J1.@13 J1.13
  Route15 0.152: J1.13 2.62,21.5 2.62,17.92 | v1.85,17.92 2.62,17.92 | 2.62,17.92 2.62,17.25 v3.61,16.26
  Route15 0.508: J1.@13 J1.13
  Bottom 0.152: J1.13 2.29,22.27 | v7.59,14.22 6.1,14.22 4.44,15.88 4.44,16.94 3.79,17.59 3.01,17.59 2.68,17.92 v1.85,17.92
GND  (via drill 0.2 pad 0.41)
  Top 0.152: U2.21 14.86,12.66 | U2.23 13.73,12.43 | 28.57,7.47 v28.65,7.39 | 11.21,13.12 U2.15 12.73,13.12 v12.96,12.89 12.96,12.86 U2.23 | 12.01,11.74 U2.18 12.75,11.74 v12.96,11.95 | U1.18 24.34,9.57 v23.98,9.93 | 23.04,12.9 C59.2 | C37.2 25.93,5.06 v26.04,4.95 | 9.91,21.64 9.91,22.27 | 14.75,11.72 v14.51,11.95 | 12.45,11.89 12.52,11.89 13.06,12.43 U2.23 | 12.74,12.17 v12.96,11.95 | 12.39,11.84 12.45,11.89 | 12.45,11.89 12.45,11.9 | v10.9,12.29 10.9,12.74 | U3.C2 | 12.96,12.28 v12.96,11.95 | 12.7,11.74 U2.23 | 12.39,12.02 12.8,12.43 | U2.23 14.05,12.43 | 14.05,12.43 14.33,12.43 14.02,12.13 | 14.05,12.43 v14.51,12.89 | 14.64,11.9 14.52,12.02 | 26.96,15.53 27.01,15.48 | 10.87,11.74 v10.87,11.79 | 8.36,11.33 R1.2 | R5.1 10.78,8.89 v10.59,8.89 | v3.06,18.47 2.94,18.34 C25.2 | v3.06,18.47 | R9.1 10.43,11.4 10.77,11.74 10.82,11.74 | R24.2 4.74,17.87 R13.2 | R34.1 27.01,16.24 27.01,15.69
  Top 0.203: 26.16,10.07 27.28,10.07 | C35.2 12.87,7.48 12.78,7.57 v12.27,7.57 | 12.88,8.36 v12.27,8.36 | 12.39,11.18 12.39,11.84 | 10.82,12.66 U2.16 12.38,12.66 v12.61,12.44 | 10.82,11.74 10.87,11.74 U2.18 12.7,11.74 | 7.23,12.98 U3.C2 | v26.55,15.74 26.55,15.7 R33.2 | 12.96,12.28 12.91,12.2 U2.17 11.35,12.2 10.94,11.79 v10.87,11.79 | U6.4 33.83,14.56 v34.27,14.13 | 12.22,12.62 11.74,13.1 U2.15 11.2,13.12 v10.9,12.82 | U2.22 15.02,13.12 14.79,12.89 v14.51,12.89 14.74,12.66 U2.21 | U2.20 14.76,12.2 v14.51,11.95 | U1.17 26.68,10.07 U1.PAD@2 25.2,9.92 U1.18 | U2.19 14.43,11.74 14.04,12.13 14.02,12.13 | C10.2 11.67,5.86 R12.2
  Top 0.254: U2.2 12.39,11.18 12.39,12.02
  Top 0.305: U6.4 32.07,15.25 | v28.37,18.14 28.35,18.11 C6.2 | v22.05,17.53 21.89,17.37 20.47,17.37 C100.P$2 20.06,17.7 v18.87,17.7 18.19,17.7 C26.2 17.78,17.29 C8.1 | v22.61,14.96 22.61,15.44 C73.2 | C72.2 23.07,14.39 v22.61,13.92 22.61,13.79 22.86,13.54 23.06,13.54 | C15.2 31.75,6.73 31.69,6.67 | C17.1 28.39,6.46 v28.68,6.17 | C102.P$2 18.47,6.96 | 10.38,17.29 C29.1 9.33,17.29 | U6.EP 31.48,15.96 31.83,16.31 31.57,16.56 U6.6 31.58,19.01 v31.62,19.05 | C31.2 12.92,8.4 12.88,8.36 | C30.2 12.87,6.14 C35.2 C32.2 12.62,8.36 v12.27,8.36 | U1.18 25.36,9.57 25.37,9.57 25.58,9.57 U1.PAD@3 | U1.17 26.16,10.07 | R33.2 R10.1 | 30.57,15.79 U6.1 30.19,14.56 30.05,14.71 v30.05,14.78 30.05,14.96 29.75,15.27 C5.2 | U5.2 8.64,10.67 8.36,10.95 8.36,11.33 | C22.2 C20.2 C13.2 | U3.C2 7.6,13 v7.7,12.9 | C36.2 11.94,10.26 v12.22,10.26 12.39,10.44 U2.2
  Top 0.381: v22.61,16.08 v22.61,13.92 | 19.77,17.34 C100.P$2 20.81,17.34 | C4.1 C8.1 16.44,17.29 | C4.1 C1.1 | C1.1 C21.1 | C21.1 C27.1 | C27.1 C23.1 | C23.1 C29.1 | 11.43,17.29 C23.1 | 12.45,17.29 C27.1 | 13.49,17.29 C21.1 | 14.53,17.29 C1.1 | 15.55,17.29 C4.1 | v27.09,15.77 27.01,15.69 27.01,15.48 27.15,15.33 R10.1
  Top 0.457: C58.2 22.77,12.23 23.04,12.5 23.04,12.9 | C59.2 23.06,12.89 23.06,13.54 23.06,14.46 C72.2 C73.2 23.07,16.04 v23.11,16.08 | C37.2 25.93,4.52 v26.16,4.29 | 28.57,7.47 C74.1 28.08,7.39 28.08,6.99 28.16,6.91 | 28.16,6.91 C17.1 28.16,6.12 28.34,5.94 C49.2 | 28.16,6.91 28.29,6.78 v28.68,6.78 | C49.2 28.34,4.49 v28.32,4.47 | C49.2 28.34,5.83 v28.68,6.17 | 32.41,8.99 31.81,8.99 C11.1 C9.1 | C9.1 32.44,8 | v32.99,6.71 31.97,6.71 C15.2 | v32.99,5.31 32.83,5.47 C57.2 C15.2 | C15.2 31.77,6.9 C9.1
  Top 0.508: J2.@9 J2.9 | J2.@10 J2.10 | J1.10 9.91,21.64 J1.@10 | C102.P$2 18.62,7.11 v18.62,8.26 | C102.P$2 18.21,5.31 v18.09,5.18 | C102.P$2 18.27,6.76
  Top 0.762: C3.2 22.7,17.34 C100.P$2
  Top 0.8: 12.65,19 1,19 1,3.86 3.17,3.86 | 11.18,3.86 11.94,3.86 | 19.56,3.86 28.09,3.86 | 34,19.1 v34,3.86 | 26.67,19.1 33.96,19.1
  Top 1.016: 12.8,12.43 U2.23 | J1.10 J1.9
  Top 1.524: J1.@9 J1.9 | J1.@10 J1.10
  Route2 0.508: 10.14,21.38 10.14,21.59 J1.10 | 10.14,21.38 10.14,19.77 v9.4,19.04 | J1.@10 10.16,21.38 10.14,21.38 | J1.@9 J1.9 12.7,19.04 v12.6,19.04 | J2.@10 J2.10 | J2.10 27.94,3.13 v27.22,3.13 | J2.@9 J2.9 | J2.9 25.4,3.28 25.65,3.28 | J2.9 J2.10
  Route15 0.152: 10.16,21.74 J1.10 | 12.7,22.27 12.7,21.72 J1.9
  Route15 0.508: J2.@9 J2.9 | J2.@10 J2.10 | J1.@10 10.16,21.74 | J1.@9 12.7,21.72
  Bottom 0.152: v12.22,10.26 18.52,10.26 18.67,10.11
  Bottom 1.524: 25.65,3.28 25.65,1.37 25.4,1.37 J2.9 J2.10 27.94,3.38 27.22,3.38 | v12.6,19.04 12.7,19.14 J1.9 J1.10 10.11,21.54 10.11,19.74 v9.4,19.04
  other vias: 13.7,12.89 13.34,12.44 14.11,12.44 12.22,11.95 13.7,11.95 0.97,19.03 0.97,17.63 0.97,10.67 0.97,9.4 0.97,8.13 0.97,6.86 0.97,5.59 0.97,3.87 34.27,17.15 34.27,16.15 34.27,15.15 26.87,19.03 16.66,17.93 15.63,17.92 14.6,17.92 13.56,17.93 12.53,17.93 11.49,17.93 8.36,13.74 12.82,5.16 18.67,5.16 8.03,18.52 10.46,17.93 2.08,19.03 3.6,19.03 5.09,19.03 5.96,19.03 6.83,19.03 1.63,19.73 27.42,19.03 28.14,19.03 30.3,19.79 32.41,19.05 33.99,19.05 0.97,12.2 0.97,13.72 0.97,14.99 0.97,16.26 11.53,3.13 12.39,3.13 20.4,3.13 21.12,3.13 21.99,3.13 23.73,3.13 26.34,3.13 19.37,3.13 34.01,3.13 34.01,4.8 34.01,6.07 34.01,7.34 34.01,8.86 34.01,10.39 34.03,11.91 34.27,13.11 34.27,18.16 8.79,18.52 7.26,18.52 10.06,18.52 11.07,18.52 12.09,18.52 13.11,18.52 11.09,3.87 11.68,4.47 12.24,5.02 1.65,4.49 2.21,4.49 2.77,4.47 17.96,8.26 28.63,3.87 27.17,4.29 32.44,8.99 26.11,18.85 22.08,16.85 1.68,18.57 1.78,16.23 18.52,4.57 17.96,4.57 32.49,8 32.99,6.02 32.99,7.37 32.99,8.64 30.71,15.58 24.6,3.13 25.47,3.13 28.09,3.13 12.22,12.89 7.95,8.92 8.43,8.92 7.7,4.47 7.52,3.96 8.18,12.67 8.36,13.16 8.36,14.29 10.36,11.15 8.43,8.43 7.95,8.43 7.47,8.92 7.47,8.43 6.38,18.5 5.58,18.49 1.85,8.13 2.11,6.99 2.11,6.1 2.11,5.19 10.87,11.28 7.63,19.03 8.43,19.03 10.5,19.03 11.6,19.03 3.2,19.73 5.6,19.73 6.4,19.73 7.2,19.73 8,19.73 8.9,19.73 10,19.73 1.83,3.87 2.53,3.87 3.23,3.87 12,3.87 25.93,3.87 26.64,3.87 27.5,3.87 32.03,19.81 33.55,19.79
  pour Bottom (rank 3, no thermals): -1.7,29.34 47.42,29.34 47.42,-1.55 -1.7,-1.55
  pour Top (rank 3, no thermals): -11.93,31.57 42.57,31.57 42.57,-4.98 -11.93,-4.98
  pour Route2 (rank 4): -3.89,30.63 44.27,30.63 44.27,-3.23 -3.89,-3.23
  pour Route15 (rank 3): -3,29.97 45.82,29.97 45.82,-2.44 -3,-2.44
  cutout Top: 0.13,2.54 0.13,0 34.67,0 34.67,2.54
  cutout Top: 1.4,22.86 0,22.86 0,20.45 0,20.32 0,20.19 34.92,20.19 34.92,22.86 34.16,22.86
  cutout Bottom: -0.25,22.86 -0.25,20.19 35.18,20.19 35.18,22.86
  cutout Bottom: -0.25,2.54 -0.25,0 35.31,0 35.31,2.54
  cutout Top: 31.11,13.44 31.57,13.44 31.57,4.85 31.11,4.85
  cutout Top: 31.29,4.98 33.07,4.98 arc-90 33.3,4.75 33.3,3.15 arc90 33.6,2.84 34.44,2.84 arc-90 34.47,2.82 34.47,2.62 arc-90 34.39,2.54 33.45,2.54 arc-90 33.43,2.57 33.12,2.57 arc-90 33.05,2.64 arc-90 32.92,2.77 32.92,4.19 arc90 32.61,4.5 31.24,4.5 31.24,4.93 arc-90
  cutout Top: 28.73,7.75 arc-90 28.98,7.49 28.98,2.57 29.54,2.57 29.54,7.67 arc90 29.31,7.9 28.75,7.9 arc90 28.73,7.87
  cutout Top (no thermals): 19.68,8.99 17.68,8.99 arc90 17.41,8.72 17.54,8.6 arc-90 17.55,8.61 18.82,8.61 arc-90 19.56,7.87 19.56,4.83 arc90 19.81,4.57 25.15,4.57 arc90 25.65,5.08 25.65,6.1 25.4,6.1 25.4,5.51 arc-90 24.71,4.83 20.45,4.83 arc-90 20.24,5.03 20.24,7.88 arc-90 19.68,8.44
  cutout Top: 25.76,6.76 26.8,6.76 26.8,5.89 arc-90 26.77,5.87 25.78,5.87 arc-90 25.76,5.89
  cutout Bottom: 30.33,12.7 30.33,10.79 33.58,10.79 33.58,12.7
  cutout Top: 25.35,12.57 25.35,10.24 25.6,10.24 25.6,12.04 28.02,12.04 28.02,9.6 25.65,9.6 25.65,9.42 28.17,9.42 28.17,12.57
  cutout Top: 11.7,13.24 15.67,13.24 15.67,12.94 15.9,12.94 15.9,13.39 11.85,13.39
  cutout Top: 15.99,11.58 11.2,11.58 11.2,11.45 15.99,11.45
  cutout Top: 15.67,12.92 15.67,11.41 16.09,11.41 16.09,12.92
  pour Top: 7.26,13.11 7.87,13.11 arc90 8.1,13.34 8.1,14.61 arc-90 8.18,14.68 8.79,14.68 8.79,12.65 arc-90 8.43,12.29 7.9,12.29 arc-90 7.7,12.5 7.7,12.62 arc90 7.42,12.9 7.26,12.9
  cutout Top: -0.05,3.35 4.11,3.35 4.11,0.46 3.61,-0.05 -0.05,-0.05
ILIM
  Top 0.152: R33.1 26.28,14.31 26.68,13.91 26.68,13.51 26.58,13.4 U1.10
N$1
  Top 0.152: J2.@3 J2.3
N$2
  Top 0.152: U1.23 27.58,7.83 C74.2 C17.2 27.04,6.28 C49.1
N$3
  cutout Top (no thermals): 28.04,17.04 29.67,17.04 29.67,14.66 28.04,14.66
N$4  (via drill 0.2 pad 0.41)
  Top 0.152: v30,10.67 29.9,10.57 U1.3
  Bottom 0.152: TP2.P$1 30.97,10.93 30.71,10.67 v30,10.67
N$5
  Top 0.152: 9.17,12.32 C14.2 9.17,12.04 | 9.13,11.43 R9.2 | U3.D2 7.21,12.55 7.25,12.51
  Top 0.305: R17.1 9.17,12.32 | 9.13,11.43 9.17,11.46 C14.2 9.12,12.17 7.6,12.17 7.21,12.56 U3.D2
N$6
  Top 0.152: U2.3 12.89,10.14 11.92,9.18 R5.2 R6.1 C28.2
N$7  (via drill 0.2 pad 0.41)
  Top 0.152: v29.57,10.07 | v29.57,10.07 U1.2
  Bottom 0.152: TP1.P$1 32.88,11.37 32.6,11.09 32.06,11.09 31.21,10.24 29.73,10.24 v29.57,10.07
N$8
  Top 0.305: R17.2 R8.1
N$9  (via drill 0.2 pad 0.41)
  Top 0.152: R6.2 10.82,8.13 v10.69,8.13 | R4.1 11.71,6.72 11.88,6.89 v12.26,6.89
  Route15 0.152: v10.69,8.13 11.02,8.13 v12.26,6.89
N$10
  Top 0.152: 12.29,0.59 12.7,0.59 J2.4 J2.@4
N$11
  Top 0.152: U2.9 U2.8 17.03,13.88 17.8,13.11 L3.1
  pour Top (no thermals): 14.3,14.22 17.59,14.22 arc-90 19.23,12.59 19.23,11.66 arc-90 18.95,11.38 16.31,11.38 arc-90 16.22,11.46 16.22,12.86 arc90 15.52,13.56 14.3,13.56
N$12
  Top 0.152: L1.1 4.19,14.87 | 5.09,13.98 5.15,13.98
  Top 0.203: U3.B1 5.66,13.4
  Top 0.305: L1.1 4.82,14.78 6.1,13.51
  pour Top (no thermals): 2.49,15.57 4.98,15.57 arc-90 5.66,14.88 5.66,14.12 arc90 6.17,13.61 6.83,13.61 arc-90 6.96,13.49 6.96,13.34 5.61,13.34 arc-90 5,13.94 arc90 4.55,14.4 2.39,14.4 2.39,15.47 arc-90
N$15  (via drill 0.2 pad 0.41)
  Top 0.152: U3.B2 | v7.7,13.59 7.51,13.4 U3.B2 | v3.63,17.07 v3.64,17.06 4.08,17.06 R16.2 R13.1
  Bottom 0.152: v3.63,17.07 4.06,16.64 4.06,15.6 6.04,13.61 7.16,13.61 7.19,13.59 v7.7,13.59
N$16
  Top 0.203: 16.79,10.13 15.95,10.13 15.48,10.6 15.27,10.6 U2.7 U2.6
  pour Top (no thermals): 14.33,11.43 14.33,10.67 arc90 14.94,10.06 16.46,10.06 arc-90 16.54,9.98 16.54,9.53 arc90 16.61,9.45 19.2,9.45 19.2,10.59 arc90 19.05,10.74 15.47,10.74 arc-90 15.09,11.13 15.09,11.28 arc90 14.94,11.43
N$17
  Top 0.152: 3.71,13 3.67,13.01 L1.2
  Top 0.203: U3.C1 3.71,13
  pour Top (no thermals): 2.39,13.46 2.39,12.29 5.18,12.29 arc90 5.66,12.78 6.81,12.78 arc90 6.91,12.88 6.91,13.06 arc90 6.83,13.13 6.71,13.13 6.65,13.08 5.11,13.08 arc-90 4.72,13.46
N$18
  Top 0.203: U5.4 7.68,6.03 C7.1
N$19
  Top 0.203: 11.79,10.98 U2.1
  Top 0.305: C36.1 11.07,10.45 11.61,10.98 11.79,10.98
N$20
  Top 0.203: U5.5 8.64,5.95 R11.2
N$21  (via drill 0.2, 0.2 pad 0.41)
  Top 0.152: C47.1 R28.1 2.96,17.13 3.37,17.54 3.37,17.89 v3.52,18.05 | R18.1 11.07,14.94 11.23,15.09 12.4,15.09 12.65,14.84 12.65,14.83 v12.81,14.67
  Top 0.203: v12.81,14.67 12.89,14.59 U2.12
  Route15 0.152: v3.52,18.05 3.95,18.05 4.06,17.93 4.06,15.65 4.88,14.83 4.88,12.68 5.77,11.79 8.45,11.79 9.16,12.49 9.16,13.41 9.95,14.2 12.47,14.2 12.81,14.54 v12.81,14.67
N$22  (via drill 0.2 pad 0.41)
  Top 0.152: v12.22,14.66 12.38,14.5 U2.13 | v5.54,16.79 R23.2 R24.1
  Route15 0.152: v12.22,14.66 12.22,14.69 11.74,15.16 5.87,15.16 5.54,15.49 v5.54,16.79
N$48  (via drill 0.2 pad 0.41)
  Top 0.152: v31.67,13.84 v31.68,13.85 31.57,13.95 U6.3 | C5.1 28.17,14.32 v27.86,14.02
  Top 0.203: 29.31,14.25 28.37,14.25 R7.2 | 29.31,14.25 29.3,14.25 C5.1 29.3,14.26 | 29.31,14.25 29.33,14.25 | v27.86,14.02 27.88,14.02
  Route15 0.152: v31.67,13.84 31.42,13.59 28.3,13.59 v27.86,14.02
N$49  (via drill 0.2 pad 0.41)
  Top 0.152: U6.2 31.07,14.08 30.87,13.88 30.12,13.88 v29.97,14.02
  Top 0.203: v29.16,18.06 29.29,17.93 C6.1 R54.2
  Route15 0.152: v29.97,14.02 30.25,14.3 31.37,14.3 32.05,14.99 32.05,16.51 31.66,16.9 29.99,16.9 29.16,17.73 v29.16,18.06
OTG
  Top 0.152: U1.8 27.58,13.33 27.81,13.56 29.91,13.56 30.32,13.16 R3.2
PG  (via drill 0.2 pad 0.41)
  Top 0.152: U2.14 11.89,14.37 v11.63,14.62 v11.63,14.63
  Top 0.508: J1.@12 J1.12
  Route2 0.508: J1.@12 J1.12
  Route15 0.152: v11.63,14.63 11.56,14.71 9.95,14.71 8.8,13.55 8.8,12.67 8.3,12.17 6.01,12.17 5.23,12.95 5.23,15.08 4.42,15.89 4.42,18.16 4.32,18.26 4.32,20.7 5.14,21.52 J1.12
  Route15 0.508: J1.@12 J1.12
  Bottom 0.152: J1.12 4.83,22.27 | J1.12 4.83,21.72 | J1.12 5.28,21.13
REGN  (via drill 0.2 pad 0.41)
  Top 0.152: U1.22 27.08,8.25 26.8,7.97 | 25.93,6.55 C37.1 25.93,6.53 v26.42,7.02 26.54,7.14 26.54,7.71 26.8,7.97 | 26.8,7.97 | J2.@8 J2.8 | R35.2 26.84,17.87 v27.1,18.14
  Route15 0.152: J2.8 22.86,3.46 v26.42,7.02 26.42,7.27 28.68,9.53 28.68,12.45 27.36,13.77 27.36,14.71 27.62,14.97 28.73,14.97 29.18,15.43 29.18,16.61 27.66,18.14 v27.1,18.14
SCL  (via drill 0.2 pad 0.41)
  Top 0.152: v29.77,11.82 29.52,11.57 U1.5 | U6.7 31.07,18.15 v31.01,18.21 | R30.2 30.48,10.05 v30.21,9.78
  Route2 0.508: J1.@2 J1.2
  Route15 0.152: J1.@2 J1.2 30.48,21.43 30.48,21.19 30.48,20.62 31.01,20.09 v31.01,18.21 31.39,18.21 31.5,18.32 33.03,18.32 33.42,17.93 33.42,12.81 32.72,12.1 30.05,12.1 v29.77,11.82 29.32,11.82 29.06,11.56 29.06,9.87 29.29,9.64 30.06,9.64 v30.2,9.78 v30.21,9.78
  Route15 0.203: J1.@2 30.48,21.19
  Route15 0.508: J1.@2 30.48,21.43
  Bottom 0.152: J1.@2 30.42,22.8 30.19,22.78
  Bottom 0.203: J1.@2 J1.2
SDA  (via drill 0.2 pad 0.41)
  Top 0.152: v30.12,18.24 30.23,18.24 30.57,17.9 U6.8 | U1.6 28.8,12.4 29.08,12.68 v29.46,12.68 29.72,12.68 30.33,12.07 30.33,11.55 30.77,11.1 R36.2
  Top 0.508: J1.@3 J1.3
  Route2 0.508: J1.@3 J1.3
  Route15 0.152: v29.46,12.68 32.63,12.68 33.05,13.09 33.05,17.76 32.86,17.94 31.78,17.94 31.5,17.65 30.78,17.65 30.2,18.24 v30.12,18.24 30.12,18.8 27.94,20.98 J1.3
  Route15 0.508: J1.@3 J1.3
  Bottom 0.152: J1.@3 J1.3
SW1
  Top 0.152: L7.P$1 22.09,6 | U1.19 25.57,8.85 24.99,8.26 | 24.99,8.26 24.93,8.2 C2.2 | U1.20 26.08,8.4 25.91,8.23 25.02,8.23 24.99,8.26
  Top 0.305: 22.55,6 L7.P$1
  pour Top (isolate 0.254, no thermals): 24.16,9.19 26.09,9.19 arc-90 26.21,9.07 26.21,8.46 arc-90 25.96,8.2 25.37,8.2 arc90 25.25,8.08 25.25,5.56 arc-90 24.59,4.9 20.57,4.9 arc-90 20.42,5.05 20.42,6.73 arc-90 20.55,6.86 23.65,6.86 arc90 23.77,6.99 23.77,8.81 arc-90
TS  (via drill 0.2 pad 0.41)
  Top 0.152: 26.05,18.15 v26.06,18.16 26.06,17.61 R35.1 R34.2 | U1.12 25.58,13.28 26.01,13.72 v26.14,13.72 26.08,13.66 U1.11
  Top 0.508: J1.@5 J1.5
  Route2 0.508: J1.@5 J1.5
  Route15 0.152: J1.@5 J1.5 22.86,21.55 22.86,21.11 23.27,20.7 24.36,20.7 25.6,19.46 25.6,18.67 26.06,18.21 v26.06,18.16 25.99,18.09 25.99,13.87 v26.14,13.72
  Route15 0.508: J1.@5 22.86,21.55
VBAT  (via drill 0.2 pad 0.41)
  Top 0.203: R54.1 27.93,16.83 v27.77,16.83
  Top 0.305: 24.77,17.65 24.52,17.32 C3.1 | 24.07,15.49 C73.1 C72.1
  Top 0.508: J1.@6 J1.6 | J1.@7 J1.7 | J1.@8 J1.8
  Top 1.524: 15.24,19.38 J1.8 J1.7 | J1.7 17.78,19.53 17.75,19.3 | 20.32,19.38 J1.6 J1.7
  Route2 0.508: J1.@7 J1.7 | J1.@6 J1.6 | J1.@8 J1.8
  Route15 0.152: 15.24,21.67 J1.8
  Route15 0.508: J1.@8 15.24,21.67 | J1.@7 J1.7 | J1.@6 J1.6
  Bottom 0.152: J1.8 J1.7 17.65,21.59
  Bottom 0.203: v27.77,16.83 27.38,17.22 24.89,17.22
  Bottom 1.524: 17.65,21.59 J1.8 15.24,19.59 14.98,19.33 | v17.52,19.84 17.78,20.09 J1.7 J1.6 20.06,21.59 20.06,19.33
  other vias: 24,13.62 24.76,14.25 14.48,19.84 15.49,19.84 16.51,19.84 18.54,19.84 19.56,19.84 20.57,19.84 14.48,18.82 15.49,18.82 16.51,18.82 17.52,18.82 18.54,18.82 19.56,18.82 20.57,18.82 24.76,15.52 24.76,12.98 24,12.35 24,16.16
  pour Top (isolate 0.254, no thermals): 24.08,11.51 arc-90 23.62,11.96 23.62,18.14 arc90 23.19,18.57 14.81,18.57 arc-90 14.05,19.33 14.05,22.76 arc-90 14.17,22.89 14.3,22.89 arc90 14.33,22.86 19.91,22.86 arc-90 19.94,22.89 20.8,22.89 arc-90 21.03,22.66 21.03,20.47 arc90 21.39,20.12 24.89,20.12 arc-90 25.17,19.84 25.17,11.51
  pour Route15 (isolate 0.254, no thermals): 14.22,22.86 14.22,18.8 arc90 14.48,18.54 23.24,18.54 arc-90 23.62,18.16 23.62,12.36 arc90 24.52,12.14 arc90 25.02,12.64 25.02,20.19 20.95,20.19 arc-90 20.83,20.32 20.83,22.86
  pour Bottom (isolate 0.305, no thermals): 24.71,20.24 14.3,20.24 arc90 14.17,20.12 14.17,18.72 arc90 14.4,18.49 23.22,18.49 arc-90 23.67,18.03 23.67,12.37 arc90 23.98,12.06 24.69,12.06 arc90 25.12,12.5 25.12,19.84 arc90
VCC  (via drill 0.2 pad 0.41)
  Top 0.152: C30.1 14.22,5.73 | 14.53,9.25 v14.47,9.19 14.42,9.14 C31.1 | U2.5 13.89,10.2 13.7,10.01 | R4.2 C28.1 v11.07,7.14
  Top 0.203: U2.4 13.39,10.33 13.7,10.02 13.7,10.01 13.7,9.3 C31.1 13.81,9.09 C32.1 C35.1 13.81,6.34 | C30.1 14.04,5.96 | J2.@6 17.58,0.61 | 17.58,0.61 J2.6 | 17.53,1.68 17.53,1.52 17.53,0.67 17.58,0.61
  Top 0.508: J2.5 15.16,1.14 15.16,0.13 J2.@5 | J2.@6 17.63,0.05 17.63,1.42 17.53,1.52 | C102.P$1 15.57,4.91 15.44,4.77 v15.23,4.77 | v15.23,4.77 15.06,4.59 15.06,3.4 v15.23,3.23 14.68,3.78 14.68,4.77 v15.23,4.77
  Top 0.635: 14.01,6.14 14.01,4.95
  Top 1: 14.81,2.38 13.83,3.36
  Top 1.016: J2.@5 15.04,1.09 15.2,1.25
  Top 1.524: 14.19,4.77 14.19,3.67 | J2.5 15.24,3.42 15.24,3.43 | J2.6 17.78,2.68
  Route2 0.508: J2.@6 J2.6 J2.5 J2.@5
  Route15 0.152: J2.@5 J2.5 | J2.@6 17.78,1.22 J2.6
  Route15 0.203: 13.96,5.47 13.91,5.52
  Route15 0.305: 13.91,5.52 13.4,6.03 12.18,6.03 v11.08,7.14 v11.07,7.14 | 13.96,5.47 v13.96,4.78 v13.96,4.77
  Route15 0.508: J2.@5 v15.24,3.22 v15.23,3.23 | J2.5 17.73,1.27 17.78,1.22 | J2.@6 17.78,2.63 17.89,2.75 17.89,0.83 17.91,0.81
  Bottom 0.508: J2.@6 17.58,1.19 | 17.58,1.19 J2.6 | J2.@5 J2.5 | 17.5,1.27 17.58,1.19
  Bottom 1.524: 17.5,1.27 J2.5 15.21,1.28 15.21,4.45 | 17.58,2.79 17.58,1.27
  other vias: 14.5,8.22 15.54,8.2 16.76,8.2 16.5,4.77 13.96,3.23 16.5,3.13 14.5,7.13
  pour Route15 (isolate 0.305, no thermals): 13.28,9.65 15.11,9.65 arc-90 15.37,9.4 15.37,8.89 arc90 15.62,8.64 16.81,8.64 arc-90 17.09,8.37 17.09,4.25 arc90 17.78,3.56 18.29,3.56 arc-90 18.54,3.3 18.54,0.51 14.22,0.51 14.22,2.29 arc90 13.72,2.79 13.59,2.79 arc-90 13.28,3.1
  pour Top (isolate 0.305, no thermals): 13.31,11.28 13.94,11.28 arc-90 14,11.23 14,10.31 arc90 14.61,9.7 15.24,9.7 arc-90 15.39,9.55 15.39,9.04 arc90 15.77,8.66 16.84,8.66 arc-90 17.25,8.26 17.25,3.86 arc90 17.55,3.56 18.01,3.56 arc-90 18.49,3.07 18.49,0.23 arc90 18.54,0.18 14.45,0.18 arc-90 14.4,0.23 14.4,2.06 arc90 13.67,2.79 13.51,2.79 arc-90 13.18,3.12 13.18,4.55 arc-90 13.44,4.8 arc90 13.56,4.93 13.56,9.5 13.31,9.75
  pour Bottom (no thermals): 14.35,9.91 arc-90 14.45,9.8 arc90 14.61,9.65 15.16,9.65 arc-90 15.37,9.45 15.37,8.86 arc90 15.6,8.64 16.87,8.64 arc-90 17.09,8.41 17.09,4.19 arc90 17.73,3.56 18.34,3.56 arc-90 18.54,3.35 18.54,0.1 arc90 18.59,0.05 14.27,0.05 14.27,2.34 arc90 13.82,2.79 13.77,2.79 arc-90 13.33,3.23 13.33,9.65 arc-90
VIN  (via drill 0.2 pad 0.41)
  Top 0.152: C57.1 30.64,4.84 30.38,4.57 30.3,4.5 | J2.12 v30.86,3.43 v29.82,3.43 30.05,3.43 | 30.38,2.87 30.38,2.64 | J2.11 30.33,1.42 | U1.24 28.08,8.19 28.19,8.08 29.62,8.08 v29.74,8.2 | U1.24 28.23,9 | 28.5,9.57 U1.1 | U1.24 28.08,8.94 v28.83,8.94
  Top 0.203: U1.24 28.08,8.82 30.6,8.82 | 30.37,8.59 30.38,8.59
  Top 0.305: 28.23,9 28.33,9 28.5,9.17 28.5,9.57
  Top 0.508: J2.@11 J2.11 | J2.@12 J2.12
  Top 1.016: J2.11 30.38,1.37 30.38,2.64 | 30.38,8.59 30.38,4.57 | 30.3,4.5 30.3,2.57 | 32.89,1.77 32.89,1.02 | J2.@12 33.02,1.64 32.01,2.66
  Top 1.524: 30.33,1.42 30.33,7.14 | J2.12 32.89,1.77 32.01,2.66 | 32.01,2.66 31.19,3.48 | 30.3,2.57 30.38,2.64 30.39,2.66 32.01,2.66
  Top 1.778: J2.11 30.48,3
  Route2 0.508: J2.@12 J2.12 J2.11 J2.@11
  Route15 0.152: 30.48,1.25 J2.11
  Route15 0.508: J2.@11 30.48,1.25 | J2.@12 J2.12
  Bottom 1.016: 32.89,0.76 33.02,0.89 J2.12 32.92,1.17 32.92,0.1 J2.@12 33.07,0.05
  Bottom 1.524: J2.11 30.48,3.03 | 31.62,3.61 33.02,2.21 33.02,1.43 33.07,1.38 33.07,0.05
  other vias: 29.79,4.55 30.86,4.55 29.82,5.97 29.74,7.37 29.74,8.92 28.85,8.26 31.98,3.43 31.95,4.06
  pour Top (isolate 0.305, no thermals): 31.01,4.75 arc90 31.42,4.34 32.64,4.34 arc-90 32.89,4.09 32.89,2.97 arc-90
  pour Route15 (isolate 0.381, no thermals): 28.88,9.27 30.73,9.27 arc-90 31.11,8.89 31.11,4.95 arc90 31.37,4.7 32.26,4.7 arc-90 32.89,4.06 32.89,3.05 arc90 33.02,2.92 arc-90 33.66,2.29 33.66,0 29.46,0 29.46,7.62 arc90 29.01,8.08 28.78,8.08 arc-90 28.57,8.28 28.57,8.97 arc-90
  pour Bottom (isolate 0.406, no thermals): 28.8,9.19 30.89,9.19 arc-90 31.04,9.04 31.04,4.95 arc90 31.62,4.37 32.61,4.37 arc-90 32.92,4.06 32.92,2.57 arc-90 32.89,2.54 29.64,2.54 arc-90 29.46,2.72 29.46,7.67 arc90 29.06,8.08 28.88,8.08 arc-90 28.63,8.33 28.63,9.02 arc-90
  pour Top (isolate 0.406, no thermals): 28.47,9.73 29.16,9.73 arc-90 29.29,9.6 29.29,9.5 29.29,9.37 arc90 29.34,9.32 30.89,9.32 arc-90 31.01,9.19 31.01,4.62 arc90 31.24,4.39 32.64,4.39 arc-90 32.79,4.24 32.79,2.57 arc-90 32.77,2.54 29.74,2.54 arc-90 29.59,2.69 29.59,7.59 arc90 29.29,7.9 27.99,7.9 arc-90 27.91,7.98 27.91,8.2 27.91,8.94 27.91,9.22 arc-90 27.97,9.27 28.24,9.27 28.42,9.27 arc90 28.47,9.32
VSYS  (via drill 0.2 pad 0.41)
  Top 0.152: U2.10 U2.11 | 6.75,14.21 6.8,14.15 6.83,14.13 6.83,14.34 6.8,14.37 | 6.75,14.21 6.62,14.33 | 6.62,14.33 6.62,14.24 6.42,14.45 | 6.62,14.33 6.62,14.55 | 6.41,14.46 6.42,14.45 | 6.62,14.55 6.49,14.55 6.41,14.46 | U3.A1 6.71,13.8 6.42,14.09 | 6.42,14.09 6.42,14.45 | U3.A1 6.54,13.8 6.19,14.15 6.28,14.3 | 6.28,14.23 6.28,14.3 | 6.28,14.3 6.28,14.33 | 6.28,14.33 6.41,14.46 | 6.41,14.46 6.28,14.23 | 6.28,14.33 6.47,14.14 U3.A1 | U3.A1 6.79,13.9 | 6.79,13.9 6.75,14.21 | 6.41,14.46 6.65,14.1 6.79,13.9 | 6.28,14.33 6.17,14.23 6.17,14.05 6.42,13.8 U3.A1 | U3.A1 6.8,14.37 | 6.8,14.37 6.62,14.55 | 6.42,14.09 6.28,14.23 | R14.1 4.71,16.52 v4.88,16.7 4.88,16.91 R16.1 | U1.15 24.7,11.07 24.62,11.15 23.9,11.15 | U1.16 24.69,10.57 24.61,10.49 23.85,10.49
  Top 0.203: U3.A1 6.8,14.15
  Top 0.305: 20.43,14.65 C100.P$1 | R14.1 4.71,17.07 | v7.73,15.71 8.12,15.71 8.25,15.58 | 8.25,15.58 8.28,15.54 8.27,15.54 7.69,14.97 6.95,14.97 6.91,15.01 | 8.25,15.58 9.33,15.58 9.91,16.15
  Bottom 0.152: 6.41,16.62 v6.76,16.62 | v4.88,16.7 4.88,16.14 5.31,15.71 v6.25,15.71
  other vias: 21.47,10.88 21.47,10.37 20.3,10.88 20.88,10.88 6.76,16.16 6.76,15.71 7.24,15.71 20.88,10.37 22.05,10.37 20.3,10.37 7.24,16.62 7.24,16.16 22.07,10.88
  pour Top (no thermals): 13.62,12.46 arc90 13.72,12.36 14.33,12.36
  pour Route15 (isolate 0.254): 16.26,16.76 6.35,16.76 arc90 6.05,16.46 6.05,15.27 8.05,15.27 arc-90 8.23,15.44 12.62,15.44 arc-90 13.34,14.73 13.34,14.35 18.92,14.35 arc-90 19.81,13.46 19.81,8.31 arc90 20.24,7.87 22.61,7.87 arc90 22.99,8.26 22.99,11.18 22.35,11.18 arc-90 22.1,11.43 22.1,15.42 arc90 21.18,16.33 16.71,16.33 arc-90 16.61,16.43 16.59,16.43 arc90
  pour Top (isolate 0.254, no thermals): 5.99,16.74 5.99,14.15 6.76,14.15 arc-90 7.52,14.91 7.62,14.91 arc90 7.92,15.21 7.92,15.47 12.78,15.47 arc-90 13.34,14.91 13.34,13.54 13.94,13.54 13.94,14.55 arc-90 14.25,14.86 17.75,14.86 arc-90 19.81,12.8 19.81,8.64 arc90 20.57,7.87 22.99,7.87 arc90 23.37,8.26 23.37,10.29 arc-90 23.55,10.46 25.27,10.46 25.27,11.18 22.35,11.18 arc-90 22.1,11.43 22.1,15.37 arc90 20.98,16.48 17.32,16.48 arc-90 17.09,16.71 arc90 17.07,16.74
  pour Bottom: 20.62,16.99 6.4,16.99 arc90 6.1,16.69 6.1,15.59 arc90 6.77,14.92 7.93,14.92 arc90 8.08,15.06 arc-90 8.48,15.47 12.78,15.47 arc-90 13.74,14.5 13.74,14.38 18.9,14.38 arc-90 19.81,13.46 19.81,10.27 arc90 20.22,9.86 23.07,9.86 arc90 23.37,10.16 arc-90 23.62,10.41 23.88,10.41 arc90 24.13,10.67 24.13,10.9 arc90 23.85,11.18 22.38,11.18 arc-90 22.1,11.46 22.1,15.52 arc90
  pour Top (no thermals): 7.67,16.71 7.9,16.26 arc90
  pour Route2: 19.89,11.2 22.66,11.2 arc-90 22.83,11.02 22.83,10.03 arc-90 22.68,9.88 20.02,9.88 19.81,9.88 arc-90 19.66,10.03 19.66,11.02 arc-90 19.84,11.2
  pour Route2: 6.22,16.87 7.82,16.87 arc-90 8,16.69 8,15.57 arc-90 7.85,15.42 6.22,15.42 arc-90 6.07,15.57 6.07,16.71 arc-90
  pour Top (no thermals): 6.1,17.48 8.1,17.48 arc-90 8.2,17.37 8.2,16.99 arc90 8.46,16.74 8.46,16.1 5.99,16.1 5.99,17.37 arc-90

### Text on the board
Top: T1
Route2: G2
Route15: P3
Bottom: B4
tPlace: B
bPlace: EN | PG | RST | GND | GND | VBAT | VBAT | VBAT | TS | !INT | SDA | SCL | CHG | PM-BAT v1.0 | 3V3 AUX | 3V3 | VCC | VCC | GND | GND | VIN | VIN | NC | NC | EN_AUX | REGN
tValues: 1.5uH | 1.5uH
Reference: 40*27mm
tDocu: L1 | L3 | SHLD
bDocu: CON1 | CON2